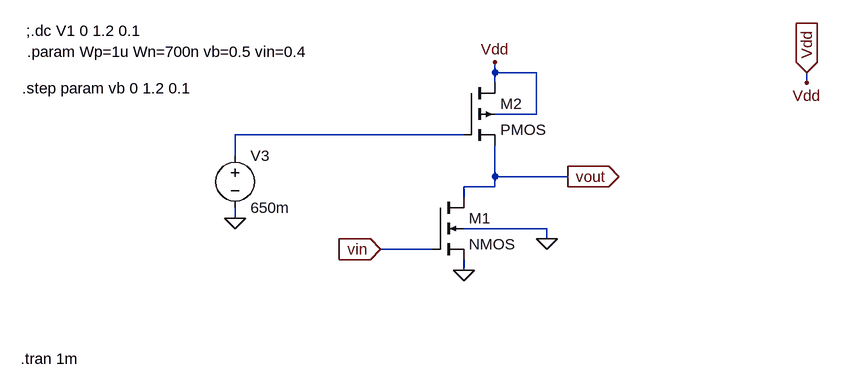
[diagram p0: schematic bias_inverter.asc]
bias_inverter.asc, the LTspice schematic file:
Version 4
SHEET 1 880 680
WIRE -2992 -32416 -2992 -32432
WIRE -2928 -32416 -2992 -32416
WIRE -2992 -32400 -2992 -32416
WIRE -2512 -32400 -2512 -32416
WIRE -2928 -32352 -2928 -32416
WIRE -2928 -32352 -2992 -32352
WIRE -3040 -32320 -3392 -32320
WIRE -3392 -32288 -3392 -32320
WIRE -2992 -32256 -2992 -32304
WIRE -2880 -32256 -2992 -32256
WIRE -2992 -32240 -2992 -32256
WIRE -2992 -32240 -3040 -32240
WIRE -3040 -32224 -3040 -32240
WIRE -3392 -32192 -3392 -32208
WIRE -2912 -32176 -3040 -32176
WIRE -2912 -32160 -2912 -32176
WIRE -3088 -32144 -3168 -32144
WIRE -3040 -32112 -3040 -32128
FLAG -3040 -32112 0
FLAG -2912 -32160 0
FLAG -2992 -32432 Vdd
FLAG -2512 -32416 Vdd
IOPIN -2512 -32416 In
FLAG -3392 -32192 0
FLAG -3168 -32144 vin
IOPIN -3168 -32144 In
FLAG -2880 -32256 vout
IOPIN -2880 -32256 Out
FLAG -2512 -32400 Vdd
SYMBOL nmos4 -3088 -32224 R0
SYMATTR InstName M1
SYMATTR Value2 l=1u w=Wn
SYMBOL pmos4 -3040 -32400 R0
SYMATTR InstName M2
SYMATTR Value2 l=400n w=Wp
SYMBOL voltage -3392 -32304 R0
WINDOW 123 0 0 Left 0
WINDOW 39 0 0 Left 0
SYMATTR InstName V3
SYMATTR Value 650m
TEXT -3714 -32480 Left 2 !;.dc V1 0 1.2 0.1
TEXT -3712 -32448 Left 2 !.param Wp=1u Wn=700n vb=0.5 vin=0.4
TEXT -3720 -32392 Left 2 !.step param vb 0 1.2 0.1
TEXT -3722 -31976 Left 2 !.tran 1m

The netlist it stands for:
* bias_inverter.asc
M1 vout vin 0 0 NMOS l=1u w=Wn
M2 Vdd N001 vout Vdd PMOS l=400n w=Wp
V3 N001 0 650m
.model NMOS NMOS
.model PMOS PMOS
.lib standard.mos
;.dc V1 0 1.2 0.1
.param Wp=1u Wn=700n vb=0.5 vin=0.4
.step param vb 0 1.2 0.1
.tran 1m
.backanno
.end